# EAGLE design Skaarhoj BI8-SE-C30 (EAGLE 6.2)
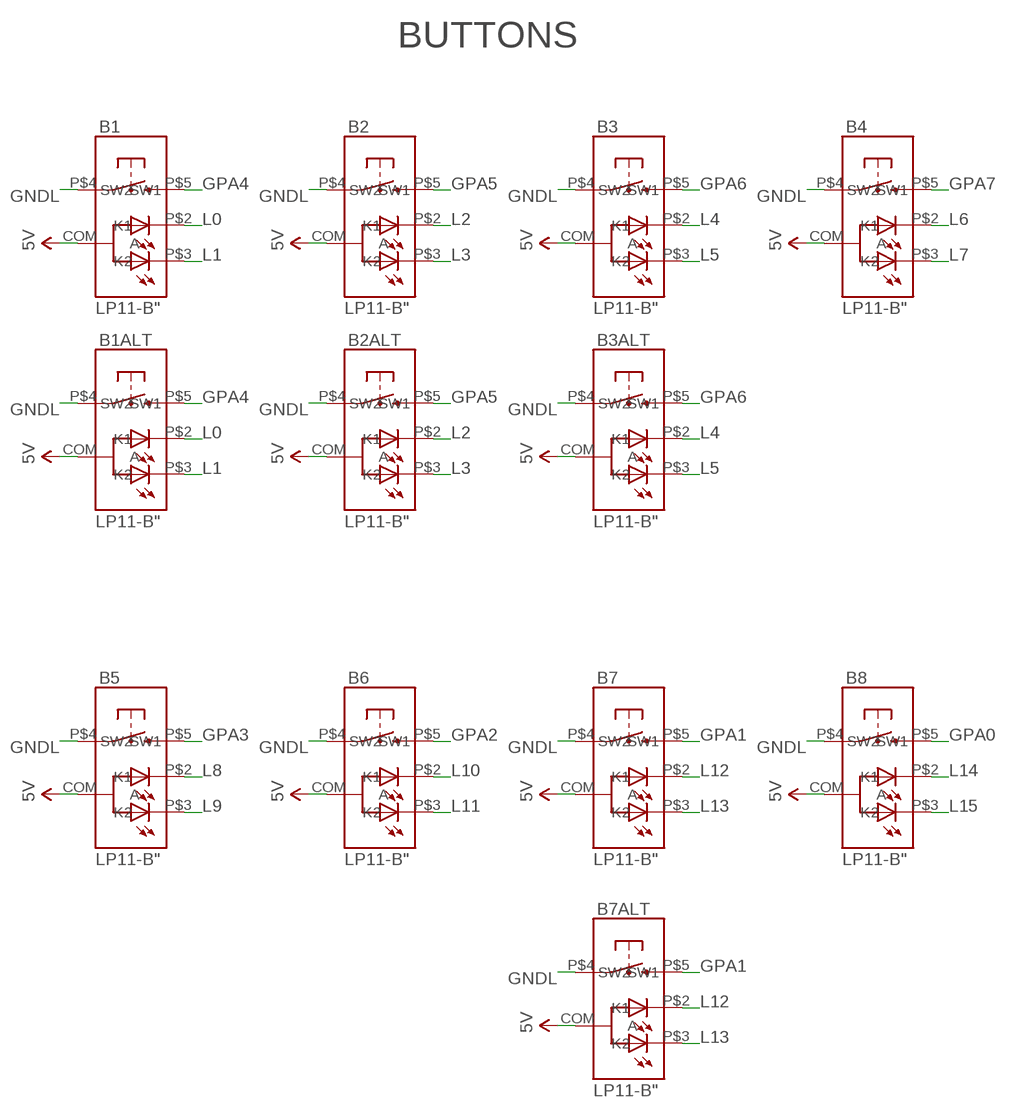
[diagram p0: schematic, sheet 1, part 1 of 2]
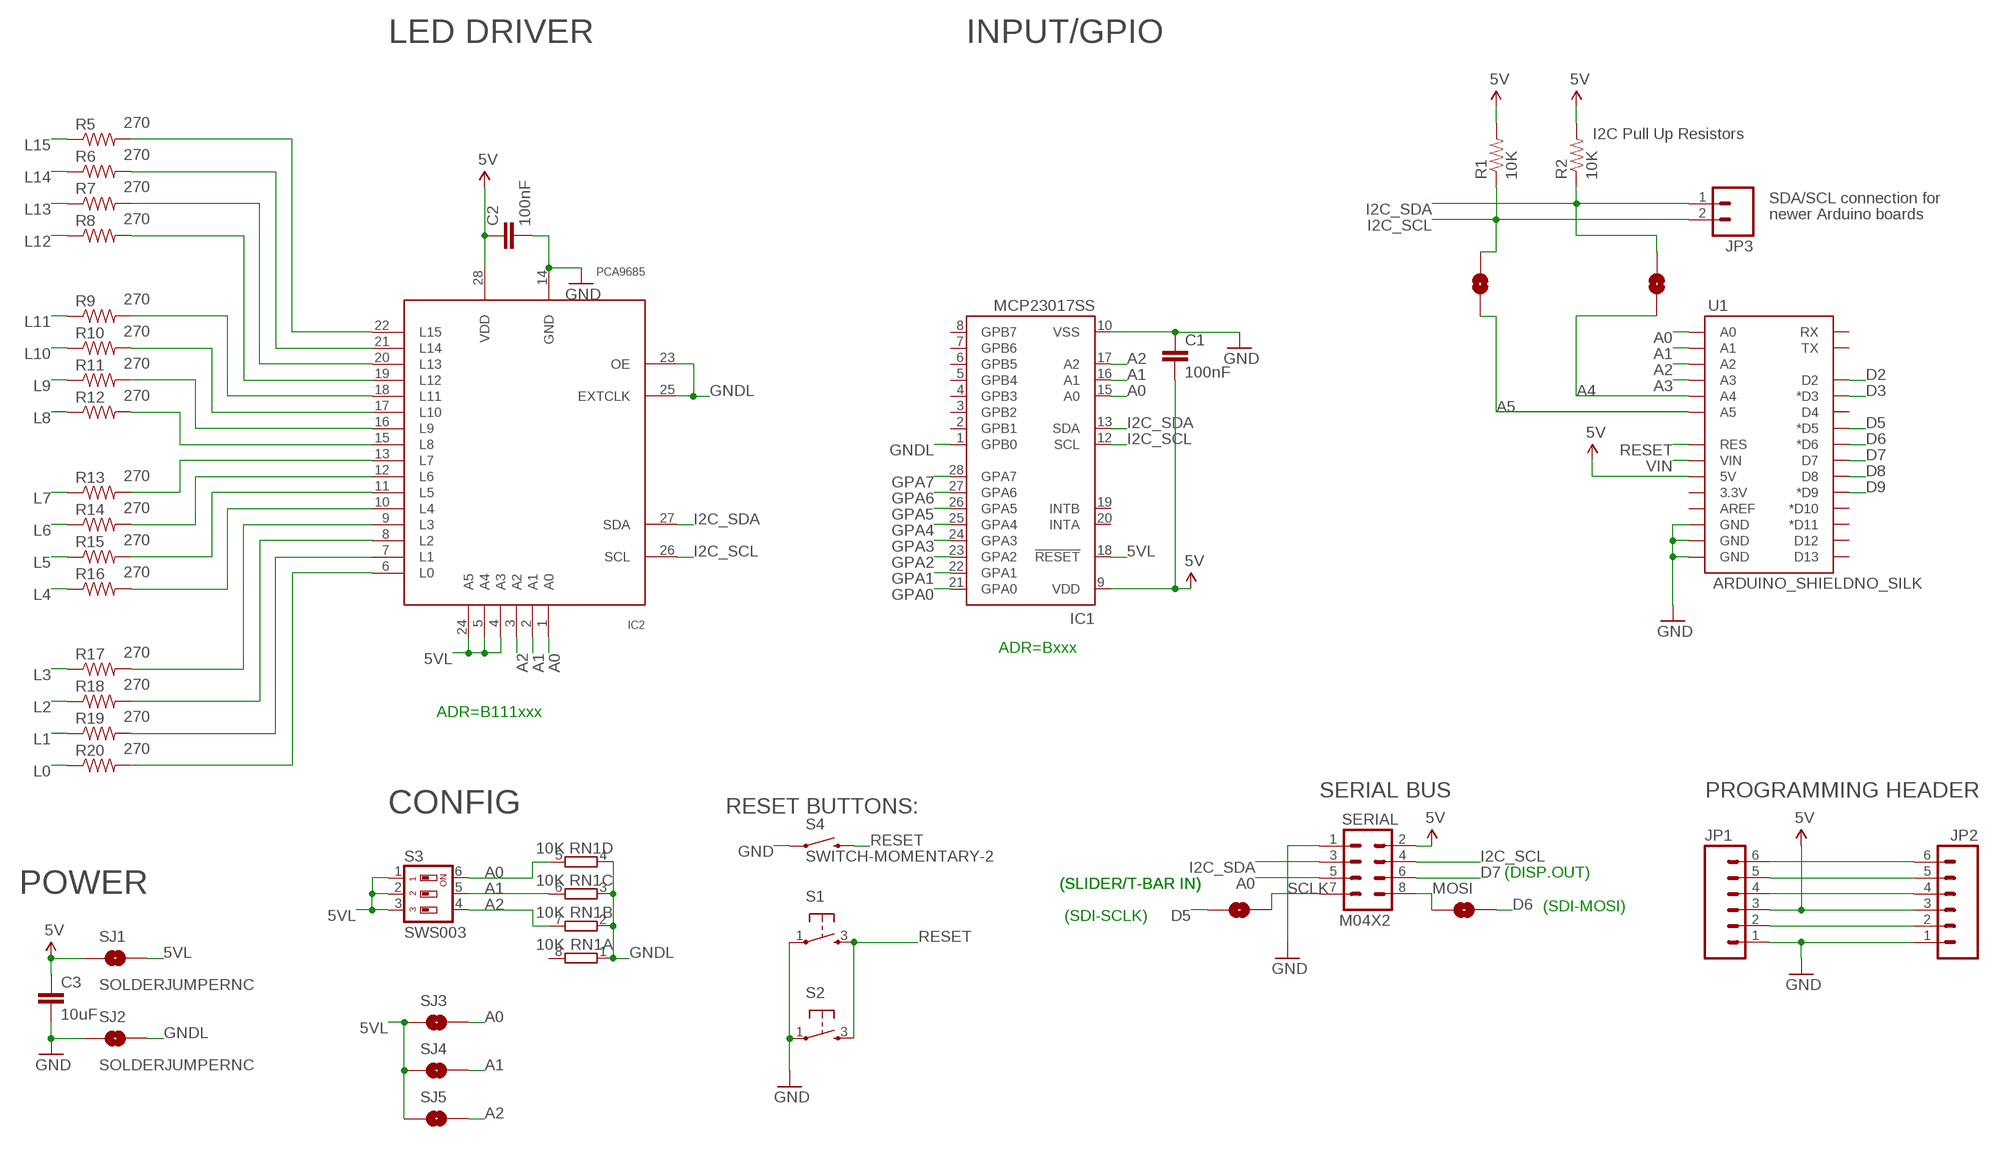
[diagram p1: schematic, sheet 1, part 2 of 2]

## Parts
B1  LP11-B"  [LP11]
B1ALT  LP11-B"  [LP11]
B2  LP11-B"  [LP11]
B2ALT  LP11-B"  [LP11]
B3  LP11-B"  [LP11]
B3ALT  LP11-B"  [LP11]
B4  LP11-B"  [LP11]
B5  LP11-B"  [LP11]
B6  LP11-B"  [LP11]
B7  LP11-B"  [LP11]
B7ALT  LP11-B"  [LP11]
B8  LP11-B"  [LP11]
C1  100nF  CAP0603-CAP  [0603-CAP]
C2  100nF  CAP0603-CAP  [0603-CAP]
C3  10uF  CAP0805  [0805]
IC1  MCP23017SS  [SSOP28]
IC2  PCA9685  [TSSOP28]
JP1  M06POLAR  [MOLEX-1X6]
JP2  M06POLAR  [MOLEX-1X6]
JP3  M02PTH  [1X02]
MOSI->D6  SOLDERJUMPERNC  [SJ_2S]
R1  10K  RESISTOR0603-RES  [0603-RES]
R2  10K  RESISTOR0603-RES  [0603-RES]
R5  270  RESISTOR0603-RES  [0603-RES]
R6  270  RESISTOR0603-RES  [0603-RES]
R7  270  RESISTOR0603-RES  [0603-RES]
R8  270  RESISTOR0603-RES  [0603-RES]
R9  270  RESISTOR0603-RES  [0603-RES]
R10  270  RESISTOR0603-RES  [0603-RES]
R11  270  RESISTOR0603-RES  [0603-RES]
R12  270  RESISTOR0603-RES  [0603-RES]
R13  270  RESISTOR0603-RES  [0603-RES]
R14  270  RESISTOR0603-RES  [0603-RES]
R15  270  RESISTOR0603-RES  [0603-RES]
R16  270  RESISTOR0603-RES  [0603-RES]
R17  270  RESISTOR0603-RES  [0603-RES]
R18  270  RESISTOR0603-RES  [0603-RES]
R19  270  RESISTOR0603-RES  [0603-RES]
R20  270  RESISTOR0603-RES  [0603-RES]
RN1  10K  4R-NCAY16  [CAY16_HAND]
S1  TAC_SWITCH  [PUSHBUTTON]
S2  TAC_SWITCH  [PUSHBUTTON]
S3  SWS003  [SMS-003]
S3->A2  SOLDERJUMPERNC  [SJ_2S]
S3->A3  SOLDERJUMPERNC  [SJ_2S]
S4  SWITCH-MOMENTARY-2  [TACTILE_SWITCH_TALL]
SCLK->D5  SOLDERJUMPERNC  [SJ_2S]
SERIAL  M04X2  [2X4]
SJ1  SOLDERJUMPERNC  [SJ_2S]
SJ2  SOLDERJUMPERNC  [SJ_2S]
SJ3  SOLDERJUMPERNC  [SJ_2S]
SJ4  SOLDERJUMPERNC  [SJ_2S]
SJ5  SOLDERJUMPERNC  [SJ_2S]
U1  ARDUINO_SHIELDNO_SILK  [DUEMILANOVE_VIAS]

## Nets
5V [Power]: B1.COM(A) B1ALT.COM(A) B2.COM(A) B2ALT.COM(A) B3.COM(A) B3ALT.COM(A) B4.COM(A) B5.COM(A) B6.COM(A) B7.COM(A) B7ALT.COM(A) B8.COM(A) C1.2 C2.1 C3.1 IC1.9(VDD) IC2.28(VDD) JP1.3 JP2.3 R1.2 R2.2 SERIAL.2 SJ1.1 U1.5V
5VL: IC1.18(!RESET) IC2.4(A3) IC2.5(A4) IC2.24(A5) S3.1 S3.2 S3.3 SJ1.2 SJ3.1 SJ4.1 SJ5.1
A0: IC1.15(A0) IC2.1(A0) RN1.5 S3.6 SERIAL.5 SJ3.2 U1.A0
A1: IC1.16(A1) IC2.2(A1) RN1.6 S3.5 SJ4.2 U1.A1
A2: IC1.17(A2) IC2.3(A2) RN1.7 S3.4 SJ5.2 U1.A2
A3: U1.A3
A4: S3->A3.2 U1.A4
A5: S3->A2.2 U1.A5
D2: U1.D2
D3: U1.D3(*D3)
D5: SCLK->D5.1 U1.D5(*D5)
D6: MOSI->D6.2 U1.D6(*D6)
D7: SERIAL.6 U1.D7
D8: U1.D8
D9: U1.D9(*D9)
GND [Power]: C1.1 C2.2 C3.2 IC1.10(VSS) IC2.14(GND) JP1.1 JP2.1 S1.1 S2.1 S4.A2 SERIAL.1 SJ2.1 U1.GND@0(GND) U1.GND@1(GND) U1.GND@2(GND)
GNDL: B1.P$4(SW1) B1ALT.P$4(SW1) B2.P$4(SW1) B2ALT.P$4(SW1) B3.P$4(SW1) B3ALT.P$4(SW1) B4.P$4(SW1) B5.P$4(SW1) B6.P$4(SW1) B7.P$4(SW1) B7ALT.P$4(SW1) B8.P$4(SW1) IC1.1(GPB0) IC2.23(OE) IC2.25(EXTCLK) RN1.1 RN1.2 RN1.3 RN1.4 SJ2.2
GPA0: B8.P$5(SW2) IC1.21(GPA0)
GPA1: B7.P$5(SW2) B7ALT.P$5(SW2) IC1.22(GPA1)
GPA2: B6.P$5(SW2) IC1.23(GPA2)
GPA3: B5.P$5(SW2) IC1.24(GPA3)
GPA4: B1.P$5(SW2) B1ALT.P$5(SW2) IC1.25(GPA4)
GPA5: B2.P$5(SW2) B2ALT.P$5(SW2) IC1.26(GPA5)
GPA6: B3.P$5(SW2) B3ALT.P$5(SW2) IC1.27(GPA6)
GPA7: B4.P$5(SW2) IC1.28(GPA7)
I2C_SCL: IC1.12(SCL) IC2.26(SCL) JP3.2 R1.1 S3->A2.1 SERIAL.4
I2C_SDA: IC1.13(SDA) IC2.27(SDA) JP3.1 R2.1 S3->A3.1 SERIAL.3
L0: B1.P$2(K1) B1ALT.P$2(K1) R20.1
L1: B1.P$3(K2) B1ALT.P$3(K2) R19.1
L2: B2.P$2(K1) B2ALT.P$2(K1) R18.1
L3: B2.P$3(K2) B2ALT.P$3(K2) R17.1
L4: B3.P$2(K1) B3ALT.P$2(K1) R16.1
L5: B3.P$3(K2) B3ALT.P$3(K2) R15.1
L6: B4.P$2(K1) R14.1
L7: B4.P$3(K2) R13.1
L8: B5.P$2(K1) R12.1
L9: B5.P$3(K2) R11.1
L10: B6.P$2(K1) R10.1
L11: B6.P$3(K2) R9.1
L12: B7.P$2(K1) B7ALT.P$2(K1) R8.1
L13: B7.P$3(K2) B7ALT.P$3(K2) R7.1
L14: B8.P$2(K1) R6.1
L15: B8.P$3(K2) R5.1
MOSI: MOSI->D6.1 SERIAL.8
N$1: JP1.2 JP2.2
N$4: IC2.13(L7) R13.2
N$5: IC2.12(L6) R14.2
N$7: IC2.11(L5) R15.2
N$9: IC2.10(L4) R16.2
N$10: IC2.9(L3) R17.2
N$11: IC2.8(L2) R18.2
N$12: IC2.7(L1) R19.2
N$19: IC2.6(L0) R20.2
N$20: IC2.15(L8) R12.2
N$21: IC2.16(L9) R11.2
N$22: IC2.17(L10) R10.2
N$23: IC2.18(L11) R9.2
N$24: IC2.19(L12) R8.2
N$25: IC2.20(L13) R7.2
N$26: IC2.21(L14) R6.2
N$27: IC2.22(L15) R5.2
N$33: JP1.4 JP2.4
N$34: JP1.5 JP2.5
N$45: JP1.6 JP2.6
RESET: S1.3 S2.3 S4.B2 U1.RES
SCLK: SCLK->D5.2 SERIAL.7
VIN [Power]: U1.VIN
Unconnected: IC1.2(GPB1) IC1.3(GPB2) IC1.4(GPB3) IC1.5(GPB4) IC1.6(GPB5) IC1.7(GPB6) IC1.8(GPB7) IC1.19(INTB) IC1.20(INTA) RN1.8 U1.3.3V U1.AREF U1.D4 U1.D10(*D10) U1.D11(*D11) U1.D12 U1.D13 U1.RX U1.TX

## Notes on the sheet
- BUTTONS | LED DRIVER | INPUT/GPIO
- I2C Pull Up Resistors
- SDA/SCL connection for
- newer Arduino boards
- ADR=Bxxx
- ADR=B111xxx
- SERIAL BUS | PROGRAMMING HEADER
- CONFIG | RESET BUTTONS:
- (DISP.OUT)
- (SLIDER/T-BAR IN) | (SLIDER/T-BAR IN)
- POWER
- (SDI-MOSI)
- (SDI-SCLK)

## Library data of the parts
B1 B1ALT B2 B2ALT B3 B3ALT B4-B7 B7ALT B8 = SKAARHOJ:LP11-B
C1-C3 = SparkFun:CAP: Capacitor Standard 0603 ceramic capacitor, and 0.1" leaded capacitor.
IC1 = microchip:MCP23017: http://ww1.microchip.com/downloads/en/DeviceDoc/21952a.pdf Source: http://ww1.microchip.com/downloads/en/DeviceDoc/21952a.pdf; MF: MICROCHIP; MPN: MCP23017-E/SS; OC_FARNELL: 1467674; OC_NEWARK: 31K2960
IC2 = wsmith:PCA9685
JP1 JP2 = SparkFun:M06: Header 6 Standard 6-pin 0.1" header. Use with straight break away headers (SKU : PRT-00116), right angle break away headers (PRT-00553), swiss pins (PRT-00743), machine pins (PRT-00117), and female headers (PRT-00115). Molex polarized connector foot print use with SKU : PRT-08094 with associated crimp pins and housings. NOTES ON THE VARIANTS LOCK and LOCK_LONGPADS... This footprint was designed to help hold the alignment of a through-hole component (i.e. 6-pin header) while soldering it into place. You may notice that each hole has been shifted either up or down by 0.005 of an inch from it's more standard position (which is a perfectly straight line). This slight alteration caused the pins (the squares in the middle) to touch the edges of the holes. Because they are alternating, it causes a "brace" to hold the component in place. 0.005 has proven to be the perfect amount of "off-center" position when using our standard breakaway headers. Although looks a little odd when you look at the bare footprint, once you have a header in there, the alteration is very hard to notice. Also, if you push a header all the way into place, it is covered up entirely on the bottom side. This idea of altering the position of holes to aid alignment will be further integrated into the Sparkfun Library for other footprints. It can help hold any component with 3 or more connection pins.
JP3 = SparkFun:M02: Header 2 Standard 2-pin 0.1" header. Use with straight break away headers (SKU : PRT-00116), right angle break away headers (PRT-00553), swiss pins (PRT-00743), machine pins (PRT-00117), and female headers (PRT-00115). Molex polarized connector foot print use with SKU : PRT-08233 with associated crimp pins and housings.
MOSI->D6 S3->A2 S3->A3 SCLK->D5 SJ1-SJ5 = SparkFun:SOLDERJUMPER: Solder Jumper Standard SMD solder jumper. Used to automate production. Two varients : Normally Open and Normally Closed are the same, but have different paste layers. NC will have a large amount of paste and should jumper during reflow.
R1 R2 R5-R20 = SparkFun:RESISTOR: Resistor Basic schematic elements and footprints for 0603, 1206, and PTH resistors.
RN1 = SKAARHOJ:4R-N: Array Chip Resistor Source: RS Component / Phycomp; OC_FARNELL: unknown; OC_NEWARK: unknown
S1 S2 = SKAARHOJ:TAC_SWITCH: Momentary Switch Button commonly used for reset or general input. Spark Fun Electronics SKU : COM-00097
S3 = smd-special:SWS003: SMD Dip Switch 3 pol.
S4 = SparkFun:SWITCH-MOMENTARY-2
SERIAL = SparkFun:M04X2
U1 = SparkFun:ARDUINO_SHIELD

## Net classes
0 default: width 0.203 mm, drill 0.406 mm, clearance 0.203 mm
1 Power: width 0.406 mm, drill 0.61 mm, clearance 0.203 mm

## Board
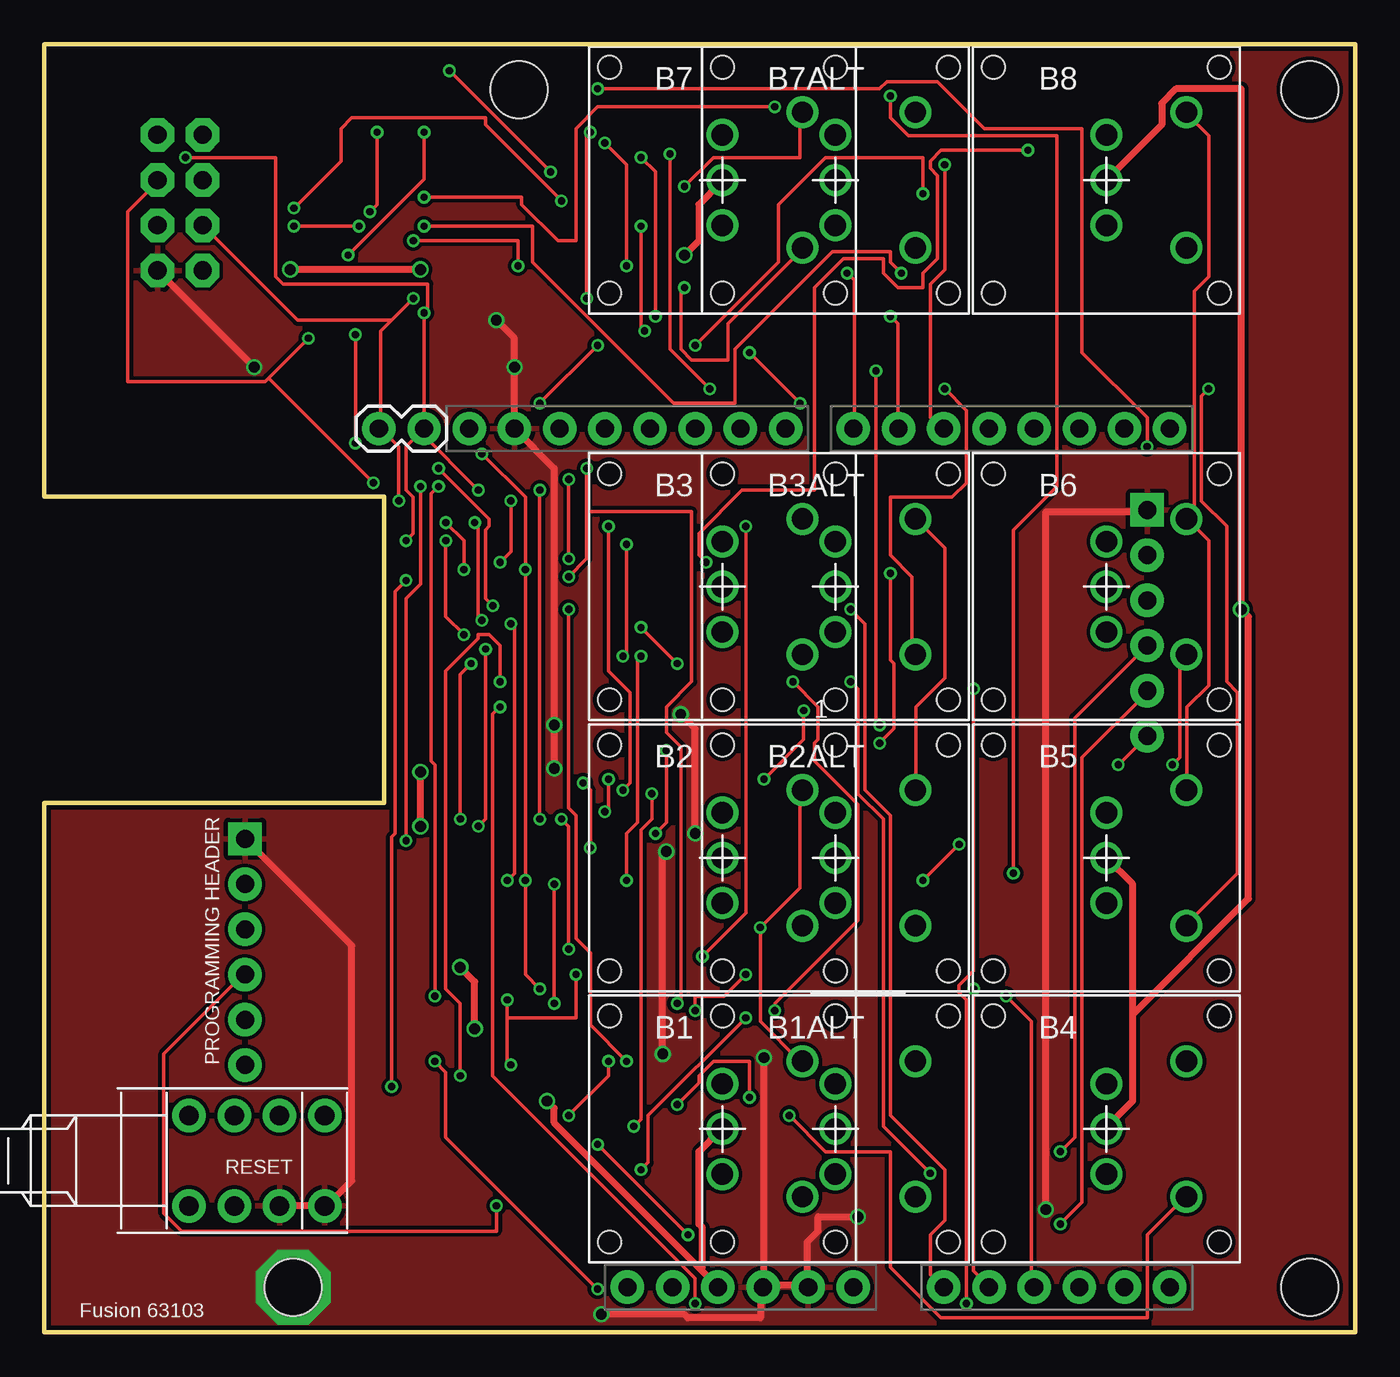
[diagram p2: board, top side]
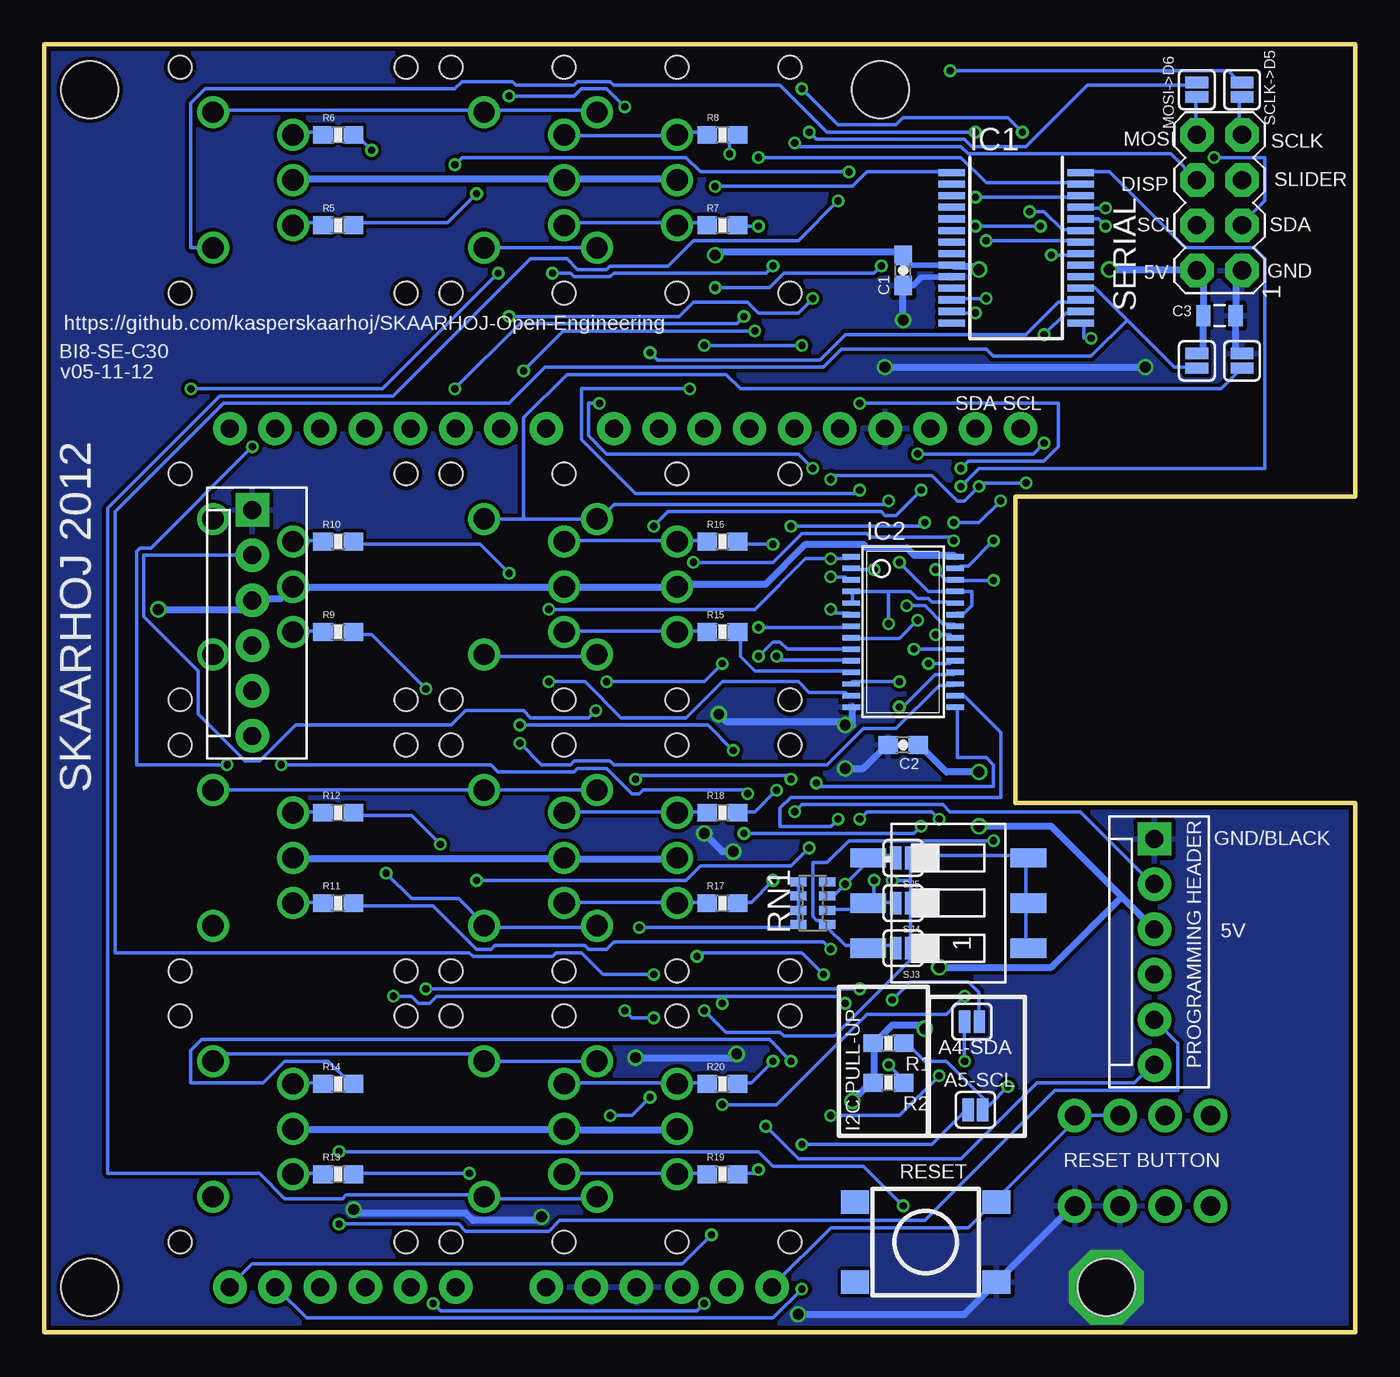
[diagram p3: board, bottom side, seen from below]

Size 73.66 x 72.39 mm. Coordinates in mm from the lower left corner, seen from the top.
Outline: 0,46.99 19.1,46.99 19.1,29.77 0,29.77 0,0 73.66,0 73.66,72.39 0,72.39 0,46.99
Copper layers (1*16): Top 0.035mm / dielectric 1.5mm / Bottom 0.035mm
Design rules: minimum track width 6mil, minimum drill 12mil, track to track 6mil, track to pad 6mil, pad to pad 6mil, via to via 6mil, smd to smd 0mil, copper to edge 10mil, drill to drill 10mil, minimum pad ring 10mil, minimum via ring 6mil, stop-mask expansion 2mil, vias tented up to drill 100mil, thermal gap 10mil
Holes 3.2 mm at 13.97,2.54 71.12,2.54 71.12,69.85 26.67,69.85
tRestrict: area 0,29.6 to 19.6,47.2
bRestrict: area 0,29.6 to 19.6,47.2

### Footprints (pad centres in the part's own frame; a part is rotated, then mirrored left to right if it is on the bottom)
LP11 = drill 1.2: COM 0,0; P$2 0,2.54; P$3 0,-2.54; P$4 4.5,3.81; P$5 4.5,-3.81 | hole 1.3: -6.35,6.35; 6.35,6.35; 6.35,-6.35; -6.35,-6.35
0603-CAP = smd 1.1 x 1: 1 -0.85,0; 2 0.85,0
0805 = smd 0.8 x 1.2: 1 -0.9,0; 2 0.9,0
SSOP28 = smd 0.4 x 1.5: 1 -4.225,-3.625; 2 -3.575,-3.625; 3 -2.925,-3.625; 4 -2.275,-3.625; 5 -1.625,-3.625; 6 -0.975,-3.625; 7 -0.325,-3.625; 8 0.325,-3.625; 9 0.975,-3.625; 10 1.625,-3.625; 11 2.275,-3.625; 12 2.925,-3.625; 13 3.575,-3.625; 14 4.225,-3.625; 15 4.225,3.625; 16 3.575,3.625; 17 2.925,3.625; 18 2.275,3.625; 19 1.625,3.625; 20 0.975,3.625; 21 0.325,3.625; 22 -0.325,3.625; 23 -0.975,3.625; 24 -1.625,3.625; 25 -2.275,3.625; 26 -2.925,3.625; 27 -3.575,3.625; 28 -4.225,3.625
TSSOP28 = smd 0.305 x 0.991: 1 -4.225,-2.918; 2 -3.575,-2.918; 3 -2.925,-2.918; 4 -2.275,-2.918; 5 -1.625,-2.918; 6 -0.975,-2.918; 7 -0.325,-2.918; 8 0.325,-2.918; 9 0.975,-2.918; 10 1.625,-2.918; 11 2.275,-2.918; 12 2.925,-2.918; 13 3.575,-2.918; 14 4.225,-2.918; 15 4.225,2.918; 16 3.575,2.918; 17 2.925,2.918; 18 2.275,2.918; 19 1.625,2.918; 20 0.975,2.918; 21 0.325,2.918; 22 -0.325,2.918; 23 -0.975,2.918; 24 -1.625,2.918; 25 -2.275,2.918; 26 -2.925,2.918; 27 -3.575,2.918; 28 -4.225,2.918
MOLEX-1X6 = drill 1.016 pad 1.88 square: 1 0,0 | drill 1.016 pad 1.88: 2 2.54,0; 3 5.08,0; 4 7.62,0; 5 10.16,0; 6 12.7,0
1X02 = drill 1.016 pad 1.88: 1 0,0; 2 2.54,0
SJ_2S = smd 0.635 x 1.27: 1 -0.412,0; 2 0.412,0
0603-RES = smd 1.1 x 1: 1 -0.85,0; 2 0.85,0
CAY16_HAND = smd 0.5 x 0.904: 1 -1.2,-0.813; 2 -0.4,-0.813; 3 0.4,-0.813; 4 1.2,-0.813; 5 1.2,0.813; 6 0.4,0.813; 7 -0.4,0.813; 8 -1.2,0.813
PUSHBUTTON = drill 1.1 pad 1.88: 1 2.54,2.54; 2 2.54,-2.54; 3 -2.54,2.54; 4 -2.54,-2.54
SMS-003 = smd 1.092 x 2.007: 1 -2.54,-4.496; 2 0,-4.496; 3 2.54,-4.496; 4 2.54,4.496; 5 0,4.496; 6 -2.54,4.496
TACTILE_SWITCH_TALL = smd 1.55 x 1.3: A1 -3.975,-2.25; A2 3.975,-2.25; B1 -3.975,2.25; B2 3.975,2.25
2X4 = drill 1.016 pad 1.88 octagon: 1 -3.81,-1.27; 2 -3.81,1.27; 3 -1.27,-1.27; 4 -1.27,1.27; 5 1.27,-1.27; 6 1.27,1.27; 7 3.81,-1.27; 8 3.81,1.27
DUEMILANOVE_VIAS = drill 1.016 pad 1.88: 3.3V 50.8,13.97; 5V 50.8,16.51; A0 50.8,29.21; A1 50.8,31.75; A2 50.8,34.29; A3 50.8,36.83; A4 50.8,39.37; A5 50.8,41.91; AREF 2.54,2.54; D2 2.54,36.83; D3 2.54,34.29; D4 2.54,31.75; D5 2.54,29.21; D6 2.54,26.67; D7 2.54,24.13; D8 2.54,20.32; D9 2.54,17.78; D10 2.54,15.24; D11 2.54,12.7; D12 2.54,10.16; D13 2.54,7.62; GND@0 50.8,19.05; GND@1 50.8,21.59; GND@2 2.54,5.08; RES 50.8,11.43; RX 2.54,41.91; TX 2.54,39.37; VIN 50.8,24.13

### Placement (x,y rotation side)
B1  38.1,11.43 0 top
B1ALT  44.45,11.43 0 top
B2  38.1,26.67 0 top
B2ALT  44.45,26.67 0 top
B3  38.1,41.91 0 top
B3ALT  44.45,41.91 0 top
B4  59.69,11.43 0 top
B5  59.69,26.67 0 top
B6  59.69,41.91 0 top
B7  38.1,64.77 0 top
B7ALT  44.45,64.77 0 top
B8  59.69,64.77 0 top
C1  25.4,59.69 90 bottom
C2  25.4,33.02 180 bottom
C3  7.62,57.15 0 bottom
IC1  19.05,60.96 270 bottom
IC2  25.4,39.37 270 bottom
JP1  61.98,46.23 270 bottom
JP2  11.27,27.74 270 bottom
JP3  21.34,50.8 180 top
MOSI->D6  8.89,69.85 90 bottom
R1  1K5  [0603-RES]  26.23,16.26 180 bottom
R2  1K5  [0603-RES]  26.23,14.03 180 bottom
R5  57.15,62.23 0 bottom
R6  57.15,67.31 0 bottom
R7  35.56,62.23 0 bottom
R8  35.56,67.31 0 bottom
R9  57.15,39.37 0 bottom
R10  57.15,44.45 0 bottom
R11  57.15,24.13 0 bottom
R12  57.15,29.21 0 bottom
R13  57.15,8.89 0 bottom
R14  57.15,13.97 0 bottom
R15  35.56,39.37 0 bottom
R16  35.56,44.45 0 bottom
R17  35.56,24.13 0 bottom
R18  35.56,29.21 0 bottom
R19  35.56,8.89 0 bottom
R20  35.56,13.97 0 bottom
RN1  30.48,24.13 270 bottom
S1  13.21,9.65 270 top
S2  10.67,9.65 270 top
S3  22.86,24.13 90 bottom
S3->A2  21.34,12.51 180 bottom
S3->A3  21.53,17.46 180 bottom
S4  24.13,5.08 0 bottom
SCLK->D5  6.35,69.85 270 bottom
SERIAL  7.62,63.5 90 bottom
SJ1  8.89,54.61 270 bottom
SJ2  6.35,54.61 270 bottom
SJ3  25.4,21.59 180 bottom
SJ4  25.4,24.13 180 bottom
SJ5  25.4,26.67 180 bottom
U1  21.34,53.34 270 top

### Tracks (layer width: path | path; a pad name or v marks a point on that pad's centre or on a via)
5V  (via drill 0.61)
  Top 0.406: v35.97,60.55 36.78,61.37 36.78,63.4 38,64.62 B7.COM | v21.13,59.74 v13.82,59.74 | v21.13,28.45 v21.13,31.5 | v28.25,13.01 28.65,12.6 28.65,11.79 36.88,3.56 | 36.88,3.56 37.8,2.64 U1.5V | v23.37,20.52 24.18,19.71 v24.18,17.07 | B1.COM 38,11.38 36.78,10.16 36.78,6.1 36.98,5.89 36.98,3.66 36.88,3.56 | B5.COM 61.16,25.2 61.16,17.88 | 61.16,17.88 61.16,13.01 59.74,11.58 B4.COM | 61.16,17.88 67.67,24.38 67.67,40.23 v67.26,40.64 67.26,69.9 63.6,69.9 62.79,69.09 62.79,67.87 B8.COM
  Bottom 0.305: IC1.9 25.4,59.98 C1.2
  Bottom 0.406: SJ1.1 8.74,55.07 8.53,55.07 8.53,57.1 C3.1 8.53,57.3 8.53,59.54 8.74,59.54 SERIAL.2 8.94,59.74 v13.82,59.74 | v35.97,60.55 35.76,60.76 25.6,60.76 25.4,60.55 C1.2 | B7.COM 38.2,64.82 44.3,64.82 B7ALT.COM 44.5,64.82 59.54,64.82 B8.COM | v21.13,59.74 21.34,59.94 22.55,59.94 IC1.9 | IC2.28 22.55,43.69 24.79,43.69 25.2,44.09 27.43,44.09 27.64,44.3 30.89,44.3 33.12,42.06 38,42.06 B3.COM 38.2,41.86 44.3,41.86 B3ALT.COM 44.5,41.86 59.54,41.86 B6.COM 60.35,41.25 61.98,41.25 JP1.3 61.98,41.05 62.38,40.64 v67.26,40.64 | B2.COM 38.2,26.62 44.3,26.62 B2ALT.COM 44.5,26.62 59.54,26.62 B5.COM | B1.COM 38.2,11.38 44.3,11.38 B1ALT.COM 44.5,11.38 59.54,11.38 B4.COM | v21.13,31.5 22.96,31.5 24.38,32.92 C2.1 | v21.13,28.45 17.07,28.45 13.11,24.49 | 13.11,24.49 11.38,22.76 JP2.3 | 27.03,16.26 27.03,14.22 R2.2 27.23,14.02 v28.25,13.01 | 13.11,24.49 17.07,20.52 v23.37,20.52 | v24.18,17.07 24.38,17.27 26.01,17.27 27.03,16.26 | 27.03,16.26 R1.2
5VL  (via drill 0.41)
  Top 0.203: v26.21,39.83 26.42,39.62 26.42,25.81 v26.01,25.4 | v39.42,20.12 38.2,18.9 36.58,18.9 v36.58,18.09
  Bottom 0.203: 12.8,56.9 14.63,58.73 15.24,58.73 IC1.18 | 12.8,56.9 10.16,54.25 8.94,54.25 SJ1.2 | 28.25,41.66 26.21,41.66 | 26.21,41.66 24.99,41.66 24.59,41.25 23.98,41.25 23.77,41.05 22.55,41.05 IC2.24 | 28.25,41.66 28.25,41.05 IC2.5 | 28.25,41.66 IC2.4 | 24.99,25.4 24.99,24.18 SJ4.1 24.99,23.98 24.99,21.74 SJ3.1 24.99,21.54 24.99,20.93 29.26,16.66 32.11,16.66 32.31,16.87 35.36,16.87 v36.58,18.09 | 24.99,25.4 24.99,26.62 SJ5.1 24.79,26.82 18.49,26.82 S3.3 18.49,26.62 18.49,24.18 S3.2 18.49,23.98 18.49,21.74 S3.1 | v26.21,39.83 26.21,41.66 | 24.99,25.4 v26.01,25.4 | 12.8,56.9 14.83,54.86 20.32,54.86 20.73,55.27 28.85,55.27 29.87,54.25 45.52,54.25 47.55,52.22 63.6,52.22 69.7,46.13 69.7,21.34 49.78,21.34 49.58,21.13 45.11,21.13 44.91,21.34 43.48,21.34 42.27,20.12 v39.42,20.12
A0  (via drill 0.41)
  Top 0.203: v45.31,40.64 46.13,39.83 46.13,30.48 47.55,29.06 47.55,12.19 50.6,9.14 50.6,6.3 49.78,5.49 49.78,3.25 50.39,2.64 U1.A0 | 12.6,53.65 12.39,53.44 4.67,53.44 4.67,62.99 6.3,64.62 SERIAL.5 | 12.6,53.65 v14.83,55.88 | v20.32,27.64 20.32,41.25 21.13,42.06 v21.13,47.55 | 12.6,53.65 v18.49,47.75 | v29.46,47.95 v29.46,43.48
  Bottom 0.203: v45.31,40.64 33.73,40.64 30.89,43.48 v29.46,43.48 28.45,43.48 IC2.1 | SJ3.2 26.01,21.74 27.23,21.74 S3.6 27.43,21.74 28.65,21.74 29.67,22.76 RN1.5 29.67,22.96 29.87,23.16 30.28,23.16 30.48,23.37 30.48,26.42 29.67,26.42 28.45,27.64 v20.32,27.64 | v14.83,55.88 15.24,55.88 15.24,56.69 IC1.15 | v18.49,47.75 20.93,47.75 v21.13,47.55 21.95,46.74 22.35,46.74 23.77,48.16 29.26,48.16 v29.46,47.95
A1  (via drill 0.41)
  Top 0.203: v17.48,49.99 v17.48,56.08 | v24.59,49.38 27.03,46.94 v27.03,42.88 v27.03,25.4 27.03,20.12 v27.84,19.3 | v52.22,19.3 52.22,3.45 53.03,2.64 U1.A1
  Bottom 0.203: RN1.6 29.67,23.77 27.64,23.77 27.43,23.98 S3.5 | v27.03,42.88 28.25,42.88 IC2.2 | 27.03,24.18 v27.03,25.4 | 27.03,24.18 27.23,24.18 S3.5 | 27.03,24.18 26.01,24.18 SJ4.2 | 27.03,24.18 S3.5 | v17.48,56.08 16.26,57.3 15.44,57.3 IC1.16 | v17.48,49.99 18.09,49.38 v24.59,49.38 | v27.84,19.3 v52.22,19.3
A2  (via drill 0.41)
  Top 0.203: v29.46,42.47 30.48,43.48 30.48,46.13 | v30.48,48.56 30.48,46.13 | v39.62,55.07 v42.47,52.22 | v28.65,18.49 v28.65,25.2 | v54.05,18.9 55.47,17.48 55.47,2.64 U1.A2 | 30.48,46.13 36.37,46.13 36.37,36.58 34.95,35.15 34.95,33.73 35.76,32.92 35.76,18.69 v35.56,18.49
  Bottom 0.203: v29.46,42.47 28.65,42.47 28.45,42.27 IC2.3 | v30.48,48.56 31.29,49.38 42.06,49.38 43.08,50.39 43.08,52.22 v42.47,52.22 | v39.62,55.07 39.22,54.66 30.07,54.66 28.65,56.08 18.49,56.08 16.66,57.91 15.44,57.91 IC1.17 | RN1.7 29.67,24.59 29.26,24.59 v28.65,25.2 27.23,26.62 S3.4 27.23,26.82 26.01,26.82 SJ5.2 | v28.65,18.49 29.06,18.9 35.56,18.9 | 35.56,18.9 51.61,18.9 52.02,18.49 52.63,18.49 53.03,18.9 v54.05,18.9 | 35.56,18.9 v35.56,18.49
A4  (via drill 0.41)
  Top 0.203: v21.95,15.24 22.55,14.63 22.55,10.97 v31.09,2.44
  Bottom 0.203: v21.95,15.24 21.95,17.27 S3->A3.2 | v31.09,2.44 32.72,0.81 58.93,0.81 60.55,2.44 U1.A4
A5  (via drill 0.41)
  Top 0.203: v36.17,5.49 v31.09,10.57
  Bottom 0.203: v31.09,10.57 23.77,10.57 21.95,12.39 S3->A2.2 | v36.17,5.49 37.8,3.86 61.98,3.86 63.2,2.64 U1.A5
D5  (via drill 0.41)
  Top 0.203: v28.45,65.23 v22.76,70.92 | v50.6,65.63 50.6,59.74 49.78,58.93 49.78,51.41 50.39,50.8 U1.D5
  Bottom 0.203: v22.76,70.92 7.11,70.92 6.5,70.31 SCLK->D5.1 | v28.45,65.23 36.78,65.23 37.59,66.04 50.19,66.04 v50.6,65.63
D6  (via drill 0.41)
  Top 0.203: v30.68,67.46 30.48,67.26 v30.48,58.12 | v47.55,57.1 47.95,56.69 47.95,50.8 U1.D6
  Bottom 0.203: v30.68,67.46 30.28,67.06 21.95,67.06 21.54,66.65 18.49,66.65 15.04,70.1 8.94,70.1 MOSI->D6.2 | v30.48,58.12 31.29,57.3 33.53,57.3 34.14,57.91 37.19,57.91 38,57.1 v47.55,57.1
D7  (via drill 0.41)
  Top 0.203: v31.5,66.85 32.72,65.63 v32.72,59.94 | v45.11,59.54 45.52,59.13 45.52,50.8 U1.D7
  Bottom 0.203: SERIAL.6 10.36,66.24 21.74,66.24 22.15,66.65 31.29,66.65 v31.5,66.85 | v32.72,59.94 33.12,59.54 41.66,59.54 41.86,59.33 43.89,59.33 44.09,59.54 v45.11,59.54
GND  (via drill 0.61, 3.2)
  Top 0.406: v28.65,31.7 v28.65,34.14 28.65,48.56 U1.GND@2 v26.42,54.25 26.42,55.88 v25.4,56.9 | v11.79,54.25 SERIAL.1 | JP2.1 11.38,27.64 17.27,21.74 17.27,8.53 15.85,7.11 S1.1 S2.1 | U1.GND@0 40.44,2.64 42.88,2.64 U1.GND@1 42.88,2.85 42.88,5.08 43.48,5.69 43.48,6.5 v45.72,6.5 | v56.29,6.91 56.29,46.13 61.98,46.13 JP1.1 | v31.29,1.02 35.97,1.02 36.17,0.81 40.23,0.81 40.23,2.44 U1.GND@0 | v35.76,34.75 36.58,33.93 v36.58,28.04 | v34.95,27.03 34.75,26.82 v34.75,15.65 | v40.44,15.44 40.44,2.85 U1.GND@0
  Bottom 0.305: C1.1 24.85,58.84 24.38,59.31 22.7,59.31 IC1.10
  Bottom 0.406: SJ2.1 6.5,55.07 6.71,55.07 6.71,57.1 C3.2 6.71,57.3 6.71,59.54 6.5,59.54 SERIAL.1 | 28.25,35.15 28.27,35.15 | 28.27,35.15 IC2.14 | 28.27,35.15 28.25,34.95 28.25,34.14 v28.65,34.14 28.85,34.34 35.36,34.34 v35.76,34.75 | v28.65,31.7 27.64,31.7 26.42,32.92 C2.2 | v25.4,56.9 C1.1 | v26.42,54.25 v11.79,54.25 | S1.1 15.85,7.11 20.12,2.85 S4.A2 20.32,2.64 21.95,1.02 v31.29,1.02 | v56.29,6.91 56.08,6.71 49.99,6.71 49.58,6.3 45.92,6.3 v45.72,6.5 | v36.58,28.04 35.56,27.03 v34.95,27.03 | v34.75,15.65 34.95,15.44 v40.44,15.44
  other vias: 13.97,2.54
  pour Top: 0,0 73.66,0 73.66,72.39 0,72.39
  pour Bottom: 0,0 73.66,0 73.66,72.39 0,72.39
GNDL  (via drill 0.41)
  Top 0.203: v25.6,43.28 26.21,43.89 v26.21,46.74 | v35.97,64.41 37.59,66.04 42.47,66.04 42.47,68.48 B7.P$4 | B2.P$4 42.47,30.48 42.47,24.99 v40.23,22.76 40.23,17.48 42.47,15.24 B1.P$4 | 64.62,45.31 65.43,44.5 65.43,36.37 64.21,35.15 64.21,30.48 B5.P$4 | 64.62,45.31 64.21,45.72 B6.P$4 64.62,45.31 | 64.62,45.31 64.62,58.52 65.43,59.33 65.43,67.26 64.21,68.48 B8.P$4 | B3ALT.P$4 48.97,45.72 50.6,44.09 50.6,36.78 48.97,35.15 48.97,30.48 B2ALT.P$4
  Bottom 0.203: IC2.23 22.35,40.44 21.95,40.44 21.54,40.84 21.54,41.66 22.35,41.66 IC2.25 22.55,41.66 23.98,41.66 v25.6,43.28 | v26.21,46.74 26.42,46.53 41.66,46.53 42.47,45.72 B3.P$4 46.74,45.72 | 46.74,45.72 46.74,51.41 44.3,53.85 35.36,53.85 34.54,53.03 7.52,53.03 6.5,54.05 SJ2.2 | B3ALT.P$4 46.74,45.72 | v35.97,64.41 28.25,64.41 27.43,65.23 22.76,65.23 IC1.1 | B7.P$4 42.67,68.68 48.77,68.68 B7ALT.P$4 48.97,68.68 64.01,68.68 B8.P$4 | B1.P$4 B1ALT.P$4 48.97,15.24 49.38,15.65 63.6,15.65 64.01,15.24 B4.P$4 | RN1.1 RN1.2 RN1.3 RN1.4 31.29,22.76 v40.23,22.76 | B2.P$4 B2ALT.P$4 B5.P$4
GPA0  (via drill 0.41)
  Top 0.203: v17.07,60.55 21.34,64.82 v21.34,67.46
  Bottom 0.203: v17.07,60.55 15.44,60.55 IC1.21 | v21.34,67.46 29.67,67.46 32.31,70.1 41.66,70.1 41.86,70.31 43.69,70.31 43.89,70.1 47.14,70.1 47.35,70.31 50.19,70.31 50.6,69.9 64.62,69.9 65.43,69.09 65.43,60.96 B8.P$5
GPA1  (via drill 0.41)
  Top 0.203: v20.73,61.37 26.62,61.37 v26.62,59.94 | v35.97,58.73 35.76,58.52 35.76,55.27 36.37,54.66 38.41,54.66 38.41,56.69 42.47,60.76 42.47,60.96 B7.P$5
  Bottom 0.203: v20.73,61.37 15.44,61.37 IC1.22 | v26.62,59.94 27.03,59.54 32.11,59.54 32.92,58.73 v35.97,58.73 | B7.P$5 B7ALT.P$5
GPA2  (via drill 0.41)
  Top 0.203: v18.29,62.99 18.69,63.4 v18.69,67.46 | v31.09,69.9 46.94,69.9 47.35,70.31 50.19,70.31 52.83,67.67 58.32,67.67 58.32,55.07 61.98,51.41 v61.98,49.78 | v63.4,31.9 63.8,32.31 63.8,37.8 64.01,38 B6.P$5
  Bottom 0.203: v18.29,62.99 17.48,62.99 16.46,61.98 15.44,61.98 IC1.23 | v18.69,67.46 19.51,68.28 25.4,68.28 25.81,67.87 29.06,67.87 v31.09,69.9 | v61.98,49.78 67.67,44.09 68.28,44.09 68.48,43.89 68.48,31.9 v63.4,31.9
GPA3  (via drill 0.41)
  Top 0.203: v17.68,62.18 v14.02,62.18 | v21.34,62.18 27.43,62.18 27.43,60.15 35.36,52.22 38.81,52.22 38.81,55.27 44.3,60.76 47.55,60.76 47.55,60.15 v48.16,59.54 | v65.43,53.03 65.02,52.63 65.02,46.74 66.45,45.31 66.45,36.58 67.06,35.97 67.06,25.81 64.21,22.96 B5.P$5
  Bottom 0.203: v14.02,62.18 14.43,62.59 15.24,62.59 IC1.24 | v21.34,62.18 v17.68,62.18 | v48.16,59.54 54.66,53.03 v65.43,53.03
GPA4  (via drill 0.41)
  Top 0.203: v14.02,63.2 16.66,65.84 16.66,67.67 17.27,68.28 24.79,68.28 24.79,67.87 v29.06,63.6
  Bottom 0.203: v14.02,63.2 15.24,63.2 IC1.25 | v29.06,63.6 31.29,61.37 37.19,61.37 38.61,59.94 41.86,59.94 42.06,59.74 43.69,59.74 44.3,60.35 46.33,60.35 54.05,52.63 63.8,52.63 70.1,46.33 70.1,8.94 61.57,8.94 60.15,7.52 56.9,7.52 56.69,7.72 48.97,7.72 B1ALT.P$5 48.77,7.52 42.67,7.52 B1.P$5
GPA5  (via drill 0.41)
  Top 0.203: v21.34,63.8 26.82,63.8 26.82,63.4 28.85,61.37 29.87,61.37 29.87,67.67 31.09,68.89 v41.05,68.89 | v47.55,69.49 47.55,68.28 48.56,67.26 56.9,67.26 56.9,47.55 54.46,45.11 v54.46,25.81
  Bottom 0.203: v21.34,63.8 15.44,63.8 IC1.26 | v41.05,68.89 42.06,69.9 43.48,69.9 43.89,69.49 v47.55,69.49 | v54.46,25.81 53.03,24.38 50.39,24.38 48.97,22.96 B2ALT.P$5 48.77,22.76 42.67,22.76 B2.P$5
GPA6  (via drill 0.41)
  Top 0.203: v33.53,66.04 34.34,65.23 v34.34,57.1 | v50.6,53.03 51.82,51.82 51.82,47.75 51,46.94 47.55,46.94 47.55,43.69 48.77,42.47 48.77,38.2 B3ALT.P$5
  Bottom 0.203: v33.53,66.04 22.15,66.04 20.73,64.62 15.44,64.62 IC1.27 | v34.34,57.1 34.75,56.69 46.94,56.69 v50.6,53.03 | B3.P$5 42.67,38 48.77,38 B3ALT.P$5
GPA7  (via drill 0.41)
  Top 0.203: v22.15,47.55 21.74,47.14 21.74,32.11 21.95,31.9 v21.95,18.9 | v35.56,12.8 36.78,14.02 36.78,14.43 37.59,15.24 39.62,15.24 v39.62,13.21 | v41.86,12.19 43.89,10.16 47.55,10.16 47.55,3.66 50.39,0.81 61.98,0.81 61.98,5.49 64.01,7.52 B4.P$5
  Bottom 0.203: v22.15,47.55 21.13,48.56 5.08,48.56 5.08,60.35 5.69,60.96 9.55,60.96 13.82,65.23 15.24,65.23 IC1.28 | v21.95,18.9 22.96,17.88 27.43,17.88 32.51,12.8 v35.56,12.8 | v39.62,13.21 40.64,12.19 v41.86,12.19
I2C_SCL  (via drill 0.41)
  Top 0.203: 19.51,56.9 18.9,56.29 18.9,50.8 | 19.51,56.9 v20.73,58.12 | SERIAL.4 14.22,56.9 19.51,56.9 | v20.32,42.27 19.71,41.66 19.71,28.04 19.51,27.84 v19.51,13.82 | 18.9,50.8 19.91,49.78 v19.91,46.74 | v22.55,45.52 23.57,44.5 v23.57,42.88 | 18.9,50.8 JP3.2
  Bottom 0.203: v20.73,58.12 22.55,58.12 IC1.12 | v20.32,42.27 22.35,42.27 IC2.26 22.55,42.27 22.96,42.27 v23.57,42.88 | 20.52,12.8 20.73,12.6 S3->A2.1 | 20.52,12.8 v19.51,13.82 | 20.52,12.8 22.96,15.24 24.18,15.24 25.2,16.26 R1.1 | v19.91,46.74 21.13,45.52 v22.55,45.52
I2C_SDA  (via drill 0.41)
  Top 0.203: v26.21,15.04 26.01,15.24 26.01,17.68 | v26.01,18.69 26.01,17.68 | v20.32,44.5 20.73,44.91 20.73,46.94 20.32,47.35 20.32,49.78 21.13,50.6 | v7.92,66.04 13.01,66.04 13.01,59.33 13.41,58.93 21.54,58.93 21.54,57.51 v21.34,57.3 JP3.1 21.13,50.6 | 26.01,17.68 29.87,17.68 v29.87,20.12 | v36.98,21.13 39.42,23.57 v39.42,45.31 | 21.13,50.6 v24.38,47.35
  Bottom 0.203: v26.21,15.04 25.4,14.22 R2.1 | v26.01,18.69 24.99,19.71 21.74,19.71 21.13,19.1 21.13,17.48 S3->A3.1 | v20.32,44.5 21.74,43.08 22.15,43.08 22.35,42.88 IC2.27 | v21.34,57.3 22.55,57.3 IC1.13 | v7.92,66.04 5.08,66.04 5.08,63.6 6.3,62.38 SERIAL.3 | v29.87,20.12 31.09,21.34 36.78,21.34 v36.98,21.13 | v39.42,45.31 38.61,46.13 26.62,46.13 26.42,45.92 25.81,45.92 v24.38,47.35
L0
  Bottom 0.203: R20.1 36.58,14.02 38,14.02 B1.P$2 38.2,14.02 44.3,14.02 B1ALT.P$2
L1
  Bottom 0.203: R19.1 36.58,8.94 38,8.94 B1.P$3 38.2,8.94 44.3,8.94 B1ALT.P$3
L2
  Bottom 0.203: R18.1 36.58,29.26 38,29.26 B2.P$2 38.2,29.26 44.3,29.26 B2ALT.P$2
L3
  Bottom 0.203: R17.1 36.58,24.18 38,24.18 B2.P$3 38.2,24.18 44.3,24.18 B2ALT.P$3
L4
  Bottom 0.203: R16.1 36.58,44.5 38,44.5 B3.P$2 38.2,44.5 44.3,44.5 B3ALT.P$2
L5
  Bottom 0.203: R15.1 36.58,39.42 38,39.42 B3.P$3 38.2,39.42 44.3,39.42 B3ALT.P$3
L6
  Bottom 0.203: R14.1 58.12,14.02 59.54,14.02 B4.P$2
L7
  Bottom 0.203: R13.1 58.12,8.94 59.54,8.94 B4.P$3
L8
  Bottom 0.203: R12.1 58.12,29.26 59.54,29.26 B5.P$2
L9
  Bottom 0.203: R11.1 58.12,24.18 59.54,24.18 B5.P$3
L10
  Bottom 0.203: R10.1 58.12,44.5 59.54,44.5 B6.P$2
L11
  Bottom 0.203: R9.1 58.12,39.42 59.54,39.42 B6.P$3
L12
  Bottom 0.203: R8.1 36.58,67.46 38,67.46 B7.P$2 38.2,67.26 44.3,67.26 B7ALT.P$2
L13
  Bottom 0.203: R7.1 36.58,62.38 38,62.38 B7.P$3 38.2,62.38 44.3,62.38 B7ALT.P$3
L14
  Bottom 0.203: R6.1 58.12,67.46 59.54,67.46 B8.P$2
L15
  Bottom 0.203: R5.1 58.12,62.38 59.54,62.38 B8.P$3
MOSI
  Bottom 0.203: MOSI->D6.1 8.94,69.29 8.94,67.46 SERIAL.8
N$1  (via drill 0.41)
  Top 0.203: v31.5,29.26 31.7,29.46 v31.7,31.09 | v40.44,31.09 42.67,33.33 v42.67,34.95
  Bottom 0.203: v31.5,29.26 31.09,29.67 23.16,29.67 22.76,29.26 15.44,29.26 11.38,25.2 JP2.2 | v31.7,31.09 31.9,31.29 40.23,31.29 v40.44,31.09 | v42.67,34.95 43.08,34.54 46.33,34.54 46.74,34.95 49.99,34.95 50.8,34.14 59.54,34.14 61.57,32.11 62.38,32.11 65.02,34.75 65.02,37.19 68.07,40.23 68.07,43.69 JP1.2
N$4  (via drill 0.41)
  Top 0.203: v45.31,36.58 45.72,36.17 45.72,30.28 47.14,28.85 47.14,11.58 v49.78,8.94
  Bottom 0.203: v45.31,36.58 43.28,36.58 41.25,34.54 37.59,34.54 35.56,36.58 31.29,36.58 30.68,35.97 28.65,35.97 28.45,35.76 IC2.13 | v49.78,8.94 56.29,8.94 R13.2
N$5  (via drill 0.41)
  Top 0.203: v25.6,36.58 25.6,38.61 24.99,39.22 24.38,39.22 24.38,39.01 22.55,37.19 22.55,19.3 23.37,18.49 v23.37,14.43 | v29.46,12.19 31.7,14.43 v31.7,15.24
  Bottom 0.203: v25.6,36.58 28.25,36.58 IC2.12 | v23.37,14.43 25.6,12.19 v29.46,12.19 | v31.7,15.24 32.92,16.46 64.82,16.46 65.43,15.85 65.43,14.02 61.37,14.02 60.15,15.24 57.71,15.24 56.49,14.02 R14.2
N$7
  Bottom 0.203: IC2.11 28.45,37.19 33.73,37.19 34.54,38 34.54,39.22 R15.2
N$9  (via drill 0.41)
  Top 0.203: v32.51,38 32.72,38.2 v32.72,44.3
  Bottom 0.203: v32.51,38 32.31,37.8 28.45,37.8 IC2.10 | v32.72,44.3 34.54,44.3 R16.2
N$10  (via drill 0.41)
  Top 0.203: v33.53,38 33.33,37.8 33.33,28.65 32.72,28.04 v32.72,25.4
  Bottom 0.203: v33.53,38 32.72,38.81 32.31,38.81 31.9,38.41 28.45,38.41 IC2.9 | v32.72,25.4 33.93,24.18 34.54,24.18 R17.2
N$11  (via drill 0.41)
  Top 0.203: v24.59,40.03 24.38,40.23 24.38,45.31 v24.18,45.52 | v31.7,45.31 31.7,37.19 32.92,35.97 32.92,30.89 v32.51,30.48
  Bottom 0.203: v24.59,40.03 25.6,39.01 28.25,39.01 IC2.8 | v24.18,45.52 24.38,45.31 v31.7,45.31 | v32.51,30.48 33.73,29.26 34.54,29.26 R18.2
N$12  (via drill 0.41)
  Top 0.203: v35.56,37.59 v33.53,39.62 | v42.06,36.58 43.48,35.15 43.48,33.33 43.28,33.12 43.28,32.11 45.72,29.67 45.72,23.16 41.05,18.49 v41.05,18.09 | v39.42,17.68 33.93,12.19 33.93,9.55 v33.53,9.14
  Bottom 0.203: v33.53,39.62 28.45,39.62 IC2.7 | v35.56,37.59 36.58,36.58 v42.06,36.58 | v41.05,18.09 40.64,17.68 v39.42,17.68 | v33.53,9.14 33.73,8.94 34.54,8.94 R19.2
N$19  (via drill 0.41)
  Top 0.203: v29.46,40.64 29.46,29.46 29.87,29.06 29.87,22.15 30.68,21.34 30.68,17.27 v32.72,15.24
  Bottom 0.203: v29.46,40.64 29.26,40.44 28.45,40.44 IC2.6 | v32.72,15.24 33.93,14.02 34.54,14.02 R20.2
N$20  (via drill 0.41)
  Top 0.203: v30.28,30.89 30.68,30.48 v30.68,27.23 | v51.41,27.43 v49.38,25.4
  Bottom 0.203: v30.28,30.89 30.07,30.68 20.32,30.68 20.32,31.9 20.73,32.31 22.35,32.31 22.35,35.15 IC2.15 | v30.68,27.23 31.7,26.21 36.78,26.21 37.59,25.4 v49.38,25.4 | v51.41,27.43 53.03,29.06 56.29,29.06 R12.2
N$21  (via drill 0.41)
  Top 0.203: v29.06,28.85 29.46,28.45 v29.46,21.54
  Bottom 0.203: v29.06,28.85 29.46,28.45 32.31,28.45 32.31,29.46 31.7,30.07 19.91,30.07 19.91,33.73 21.95,35.76 22.35,35.76 IC2.16 | v29.46,21.54 29.87,21.95 41.66,21.95 42.06,21.54 43.08,21.54 43.28,21.74 48.36,21.74 48.56,21.54 49.38,21.54 51.82,23.98 56.29,23.98 R11.2
N$22  (via drill 0.41)
  Top 0.203: v46.94,33.12 47.75,33.93 47.75,37.59 47.55,37.8 v47.55,42.67
  Bottom 0.203: v46.94,33.12 45.72,31.9 44.09,31.9 43.89,32.11 41.86,32.11 41.66,31.9 29.67,31.9 27.64,33.93 25.81,33.93 23.37,36.37 22.55,36.37 IC2.17 | v47.55,42.67 49.17,44.3 56.29,44.3 R10.2
N$23  (via drill 0.41)
  Top 0.203: v25.6,35.15 25.2,34.75 25.2,14.43 36.58,3.05 v36.58,1.63 | v51.82,1.63 51.82,18.69 51.41,19.1 51.41,19.51 52.22,20.32 v52.22,36.17
  Bottom 0.203: v25.6,35.15 25.4,35.15 23.57,36.98 22.55,36.98 IC2.18 | v36.58,1.63 36.98,1.22 51.41,1.22 v51.82,1.63 | v52.22,36.17 55.27,39.22 56.29,39.22 R9.2
N$24  (via drill 0.41)
  Top 0.203: v23.98,37.59 23.37,36.98 v23.37,28.85 | v27.84,47.35 v27.84,28.85 | v37.39,53.03 35.15,55.27 v35.15,66.24
  Bottom 0.203: v23.98,37.59 22.76,37.59 22.55,37.8 IC2.19 | v23.37,28.85 23.77,29.26 27.43,29.26 v27.84,28.85 | v27.84,47.35 28.04,47.14 40.44,47.14 43.48,50.19 43.48,53.03 v37.39,53.03 | v35.15,66.24 35.15,67.26 34.75,67.26 R8.2
N$25  (via drill 0.41)
  Top 0.203: v24.79,38.41 24.79,28.85 v24.38,28.45 | v34.34,28.04 34.95,28.65 v34.95,32.72 | v46.94,34.14 46.74,34.34 v46.74,54.05 | v33.73,56.29 33.53,56.49 v33.53,62.18
  Bottom 0.203: v24.79,38.41 22.55,38.41 IC2.20 | v24.38,28.45 24.79,28.04 v34.34,28.04 | v34.95,32.72 36.37,34.14 v46.94,34.14 | v46.74,54.05 44.5,56.29 v33.73,56.29 | v33.53,62.18 34.54,62.18 R7.2
N$26  (via drill 0.41)
  Top 0.203: v23.57,39.22 22.55,40.23 v22.55,44.5 | v37.19,43.28 36.78,43.69 36.78,44.91 39.22,47.35 43.28,47.35 43.28,58.73 44.91,60.35 47.14,60.35 47.14,59.54 47.95,58.73 49.38,58.73 49.38,59.54 50.19,60.35 50.19,65.02 49.78,65.43 49.78,65.84 50.39,66.45 v55.27,66.45
  Bottom 0.203: v23.57,39.22 22.76,39.22 22.55,39.01 IC2.21 | v22.55,44.5 22.76,44.7 27.23,44.7 27.43,44.91 31.09,44.91 32.72,43.28 v37.19,43.28 | v55.27,66.45 56.08,67.26 56.29,67.26 R6.2
N$27  (via drill 0.41)
  Top 0.203: v25.2,40.84 24.79,41.25 24.79,45.11 24.99,45.31 24.99,45.72 v22.15,48.56 | v31.09,55.47 v27.84,52.22 | v36.58,55.47 41.25,60.15 41.25,63.4 43.89,66.04 49.38,66.04 v49.38,64.01
  Bottom 0.203: v25.2,40.84 24.18,40.84 23.16,39.83 22.55,39.83 IC2.22 | v22.15,48.56 21.74,48.97 17.48,48.97 16.66,49.78 16.66,52.22 v27.84,52.22 | v36.58,55.47 v31.09,55.47 | v49.38,64.01 51,62.38 56.29,62.38 R5.2
N$33  (via drill 0.41)
  Top 0.203: v25.4,7.11 25.4,5.69 7.72,5.69 6.71,6.71 6.71,15.65 11.18,20.12 JP2.4 | v57.1,10.16 57.91,10.97 57.91,34.54 JP1.4
  Bottom 0.203: v25.4,7.11 27.64,9.35 32.72,9.35 33.53,10.16 v57.1,10.16
N$34  (via drill 0.41)
  Top 0.203: v57.1,6.1 58.32,7.32 58.32,32.31 61.98,35.97 JP1.5
  Bottom 0.203: v57.1,6.1 50.39,6.1 49.99,5.69 45.31,5.69 44.7,6.3 24.18,6.3 16.87,13.61 9.96,13.61 9.96,16.26 11.18,17.48 JP2.5
N$45  (via drill 0.41)
  Top 0.203: v33.12,11.58 33.53,11.99 33.53,28.25 34.14,28.85 v34.14,30.28 | JP1.6 v60.35,31.9
  Bottom 0.203: v33.12,11.58 31.29,9.75 22.15,9.75 17.88,14.02 12.39,14.02 11.38,15.04 JP2.6 | v34.14,30.28 34.34,30.48 40.03,30.48 40.23,30.28 40.64,30.28 42.06,31.7 43.69,31.7 43.89,31.5 48.16,31.5 48.56,31.9 v60.35,31.9
RESET
  Bottom 0.203: 15.44,12.19 20.12,7.52 S4.B2 20.32,7.32 21.74,5.89 29.46,5.89 32.72,2.64 U1.RES | S2.3 15.44,12.19 | 15.44,12.19 S1.3
SCLK
  Bottom 0.203: SCLK->D5.2 6.5,69.29 6.5,67.46 SERIAL.7

### Text on the board
_tsilk: 1 | PROGRAMMING HEADER | RESET | Fusion 63103
_bsilk: SCLK | MOSI | SLIDER | DISP | SDA | SCL | GND | 1 | 5V | https://github.com/kasperskaarhoj/SKAARHOJ-Open-Engineering | BI8-SE-C30 | v05-11-12 | SCL | SDA | SKAARHOJ 2012 | GND/BLACK | 5V | A4-SDA | PROGRAMMING HEADER | A5-SCL | I2C PULL-UP | RESET BUTTON | RESET